# EAGLE design AmpSSM2019_2312 (EAGLE 8.7.1)
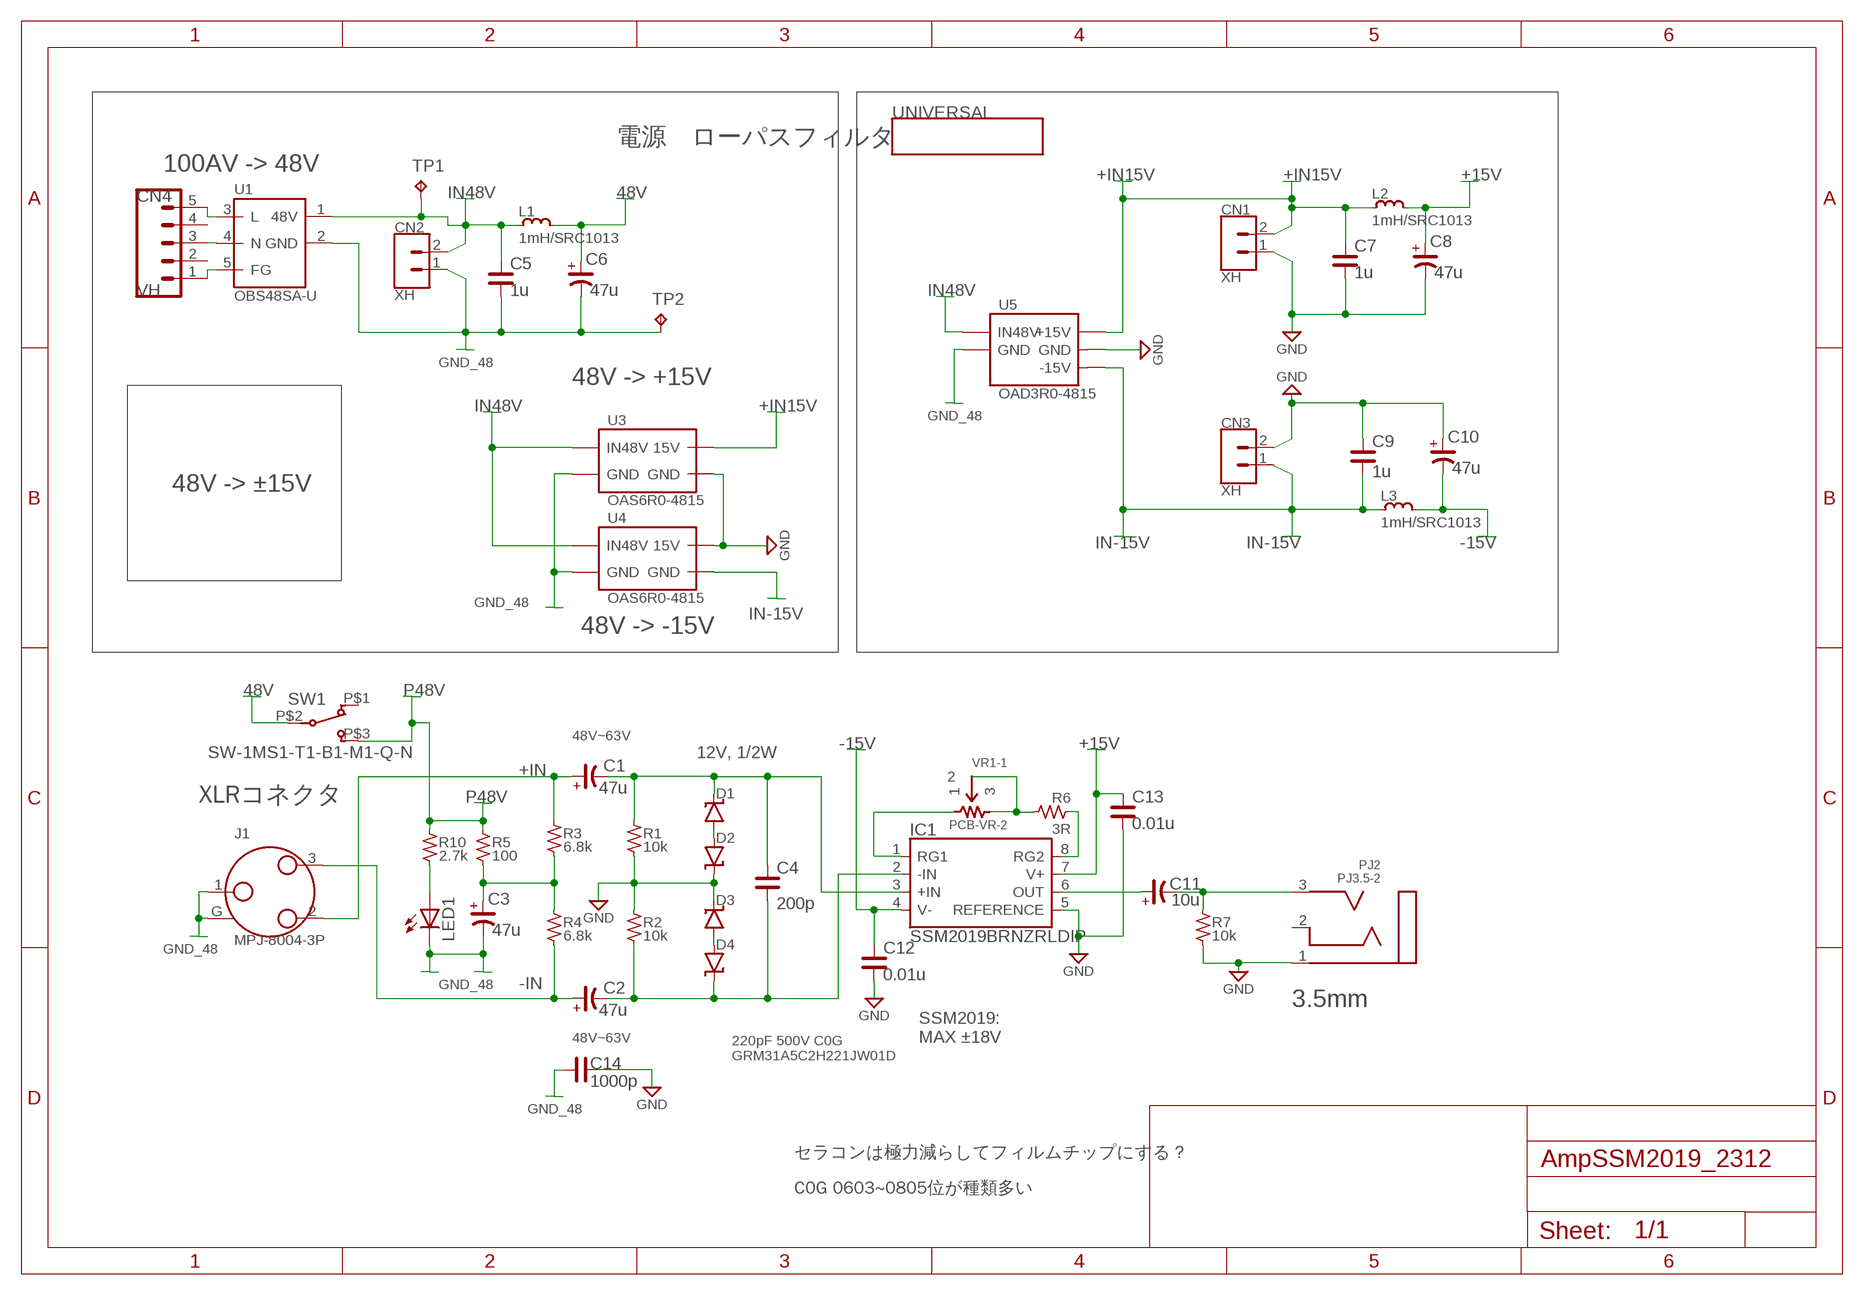
[diagram p0: schematic, sheet 1]

## Parts
C1  47u  CP_C025X065  [CE-025X065]
C2  47u  CP_C025X065  [CE-025X065]
C3  47u  CP_C025X065  [CE-025X065]
C4  200p  C_1206  [C1206]
C5  1u  C_1206  [C1206]
C6  47u  CP_C025X065  [CE-025X065]
C7  1u  C_1206  [C1206]
C8  47u  CP_C025X065  [CE-025X065]
C9  1u  C_1206  [C1206]
C10  47u  CP_C025X065  [CE-025X065]
C11  10u  CP_C025X065  [CE-025X065]
C12  0.01u  C_0603  [C0603]
C13  0.01u  C_0603  [C0603]
C14  1000p  C_1206  [C1206]
CN1  XH  CN-B2B-XH-A  [B2B-XH-A]
CN2  XH  CN-B2B-XH-A  [B2B-XH-A]
CN3  XH  CN-B2B-XH-A  [B2B-XH-A]
CN4  VH  M05VH  [VH5]
D1  ZD323  [SOD-323]
D2  ZD323  [SOD-323]
D3  ZD323  [SOD-323]
D4  ZD323  [SOD-323]
IC1  SSM2019BRNZRLDIP  [DIL08]
J1  MPJ-8004-3P  [MPJ-8004-3P]
L1  1mH/SRC1013  L_13X15  [L13X15]
L2  1mH/SRC1013  L_13X15  [L13X15]
L3  1mH/SRC1013  L_13X15  [L13X15]
LED1  LED3MM  [LED3MM]
PJ2  PJ3.5-2  [PJ3.5-2]
R1  10k  R_0603  [R0603]
R2  10k  R_0603  [R0603]
R3  6.8k  R_0603  [R0603]
R4  6.8k  R_0603  [R0603]
R5  100  R_0603  [R0603]
R6  3R  R_0603  [R0603]
R7  10k  R_0603  [R0603]
R10  2.7k  R_0603  [R0603]
SW1  SW-1MS1-T1-B1-M1-Q-N  [1MS1-T1-B1-M1-Q-N]
TP1  TPPAD1-13  [P1-13]
TP2  TPPAD1-13  [P1-13]
U1  OBS48SA-U  [OBS48SA-U]
U2  UNIVERSAL10X10  [UNIVERSAL10X10]
U3  OAS6R0-4815  [OAS6R0-4815]
U4  OAS6R0-4815  [OAS6R0-4815]
U5  OAD3R0-4815  [OAD3R0-4815]
VR1  PCB-VR-2  [PCB-VR-2]

## Nets
48V: C6.+ L1.2 SW1.P$2(P)
+15V: C8.+ C13.2 IC1.7(V+) L2.2
+IN: C1.+ J1.2 R3.2
+IN15V: C7.2 CN1.2 L2.1 U3.V_OUT(15V) U5.V+_OUT(+15V)
-15V: C10.- C12.2 IC1.4(V-) L3.2
-IN: C2.+ J1.3 R4.1
FG: CN4.1 U1.5(FG)
GND: C7.1 C8.- C9.1 C10.+ C12.1 C13.1 C14.1 CN1.1 CN3.2 D2.K(C) D3.K(C) IC1.5(REFERENCE) PJ2.1(S) R1.1 R2.2 R7.1 U3.G_OUT(GND) U4.V_OUT(15V) U5.G_OUT(GND) ; supply symbol labelled G
GND_48: C3.- C5.1 C6.- C14.2 CN2.1 J1.1 J1.G LED1.K(C) TP2.TP U1.2(GND) U3.G_IN(GND) U4.G_IN(GND) U5.G_IN(GND)
IN48V: C5.2 CN2.2 L1.1 TP1.TP U1.1(48V) U3.VIN(IN48V) U4.VIN(IN48V) U5.VIN(IN48V)
IN-15V: C9.2 CN3.1 L3.1 U4.G_OUT(GND) U5.V-_OUT(-15V)
L: CN4.5 U1.3(L)
N: CN4.3 U1.4(N)
N$1: IC1.8(RG2) R6.1
N$2: IC1.1(RG1) VR1.3
N$3: R6.2 VR1.1 VR1.2
N$4: C1.- C4.2 D1.K(C) IC1.3(+IN) R1.2
N$5: C11.+ IC1.6(OUT)
N$6: C2.- C4.1 D4.K(C) IC1.2(-IN) R2.1
N$7: D1.A D2.A
N$8: C11.- PJ2.3(TIP) R7.2
N$9: C3.+ R3.1 R4.2 R5.1
N$10: D3.A D4.A
N$14: LED1.A R10.1
P48V: R5.2 R10.2 SW1.P$3(S)
Unconnected: CN4.2 CN4.4 PJ2.2(RING) SW1.P$1(O) VR1.4 VR1.5 VR1.6

## Notes on the sheet
- 電源　ローパスフィルタ
- 100AV -> 48V
- 48V -> +15V
- 48V -> ±15V
- 48V -> -15V
- 48V~63V
- 12V, 1/2W
- XLRコネクタ
- 3.5mm
- 48V~63V
- SSM2019:
  MAX ±18V
- 220pF 500V C0G
  GRM31A5C2H221JW01D
- セラコンは極力減らしてフィルムチップにする？
- C0G 0603~0805位が種類多い

## Library data of the parts
C1-C3 C6 C8 C10 C11 = 0JimCom-Cap:CP_
C4 C5 C7 C9 C12-C14 = Miya_IC:C_: NON-POLARIZED CAP
CN1-CN3 = my_lib:CN-B2B-XH-A
CN4 = Miya_Parts:M05: Header 3 Standard 3-pin 0.1" header.
D1-D4 = my_lib:ZD
IC1 = SamacSys_Parts:SSM2019BRNZRL: Audio Preamplifier Source: Datasheet <http://componentsearchengine.com/Datasheets/1/SSM2019BRNZRL.pdf>
J1 = Miya_Parts:MPJ-8004-3P
L1-L3 = Miya_IC:L_: INDUCTOR
LED1 = 0JimCom-Analog:LED: LED OSRAM: - CHIPLED LG R971, LG N971, LY N971, LG Q971, LY Q971, LO R971, LY R971 LH N974, LH R974 LS Q976, LO Q976, LY Q976 LO Q996 - Hyper CHIPLED LW Q18S LB Q993, LB Q99A, LB R99A - SideLED LS A670, LO A670, LY A670, LG A670, LP A670 LB A673, LV A673, LT A673, LW A673 LH A674 LY A675 LS A676, LA A676, LO A676, LY A676, LW A676 LS A679, LY A679, LG A679 - Hyper Micro SIDELED® LS Y876, LA Y876, LO Y876, LY Y876 LT Y87S - SmartLED LW L88C, LW L88S LB L89C, LB L89S, LG L890 LS L89K, LO L89K, LY L89K LS L896, LA L896, LO L896, LY L896 - TOPLED LS T670, LO T670, LY T670, LG T670, LP T670 LSG T670, LSP T670, LSY T670, LOP T670, LYG T670 LG T671, LOG T671, LSG T671 LB T673, LV T673, LT T673, LW T673 LH T674 LS T676, LA T676, LO T676, LY T676, LB T676, LH T676, LSB T676, LW T676 LB T67C, LV T67C, LT T67C, LS T67K, LO T67K, LY T67K, LW E67C LS E67B, LA E67B, LO E67B, LY E67B, LB E67C, LV E67C, LT E67C LW T67C LS T679, LY T679, LG T679 LS T770, LO T770, LY T770, LG T770, LP T770 LB T773, LV T773, LT T773, LW T773 LH T774 LS E675, LA E675, LY E675, LS T675 LS T776, LA T776, LO T776, LY T776, LB T776 LHGB T686 LT T68C, LB T68C - Hyper Mini TOPLED® LB M676 - Mini TOPLED Santana® LG M470 LS M47K, LO M47K, LY M47K Source: http://www.osram.convergy.de - LUMILED® LXK2-PW12-R00, LXK2-PW12-S00, LXK2-PW14-U00, LXK2-PW14-V00 LXK2-PM12-R00, LXK2-PM12-S00, LXK2-PM14-U00 LXK2-PE12-Q00, LXK2-PE12-R00, LXK2-PE12-S00, LXK2-PE14-T00, LXK2-PE14-U00 LXK2-PB12-K00, LXK2-PB12-L00, LXK2-PB12-M00, LXK2-PB14-N00, LXK2-PB14-P00, LXK2-PB14-Q00 LXK2-PR12-L00, LXK2-PR12-M00, LXK2-PR14-Q00, LXK2-PR14-R00 LXK2-PD12-Q00, LXK2-PD12-R00, LXK2-PD12-S00 LXK2-PH12-R00, LXK2-PH12-S00 LXK2-PL12-P00, LXK2-PL12-Q00, LXK2-PL12-R00 Source: www.luxeon.com
PJ2 = my_lib:PJ3.5-2
R1-R7 R10 = Miya_IC:R_: RESISTOR
SW1 = Miya_Parts:SW-1MS1-T1-B1-M1-Q-N
TP1 TP2 = testpad:TP: Test pad
U1 = Miya_Parts:OBS48SA-U
U2 = Miya_Parts:UNIVERSAL
U3 U4 = Miya_Parts:OAS6R0-4815
U5 = Miya_Parts:OAD3R0-4815
VR1 = my_lib:PCB-VR-2

## Board
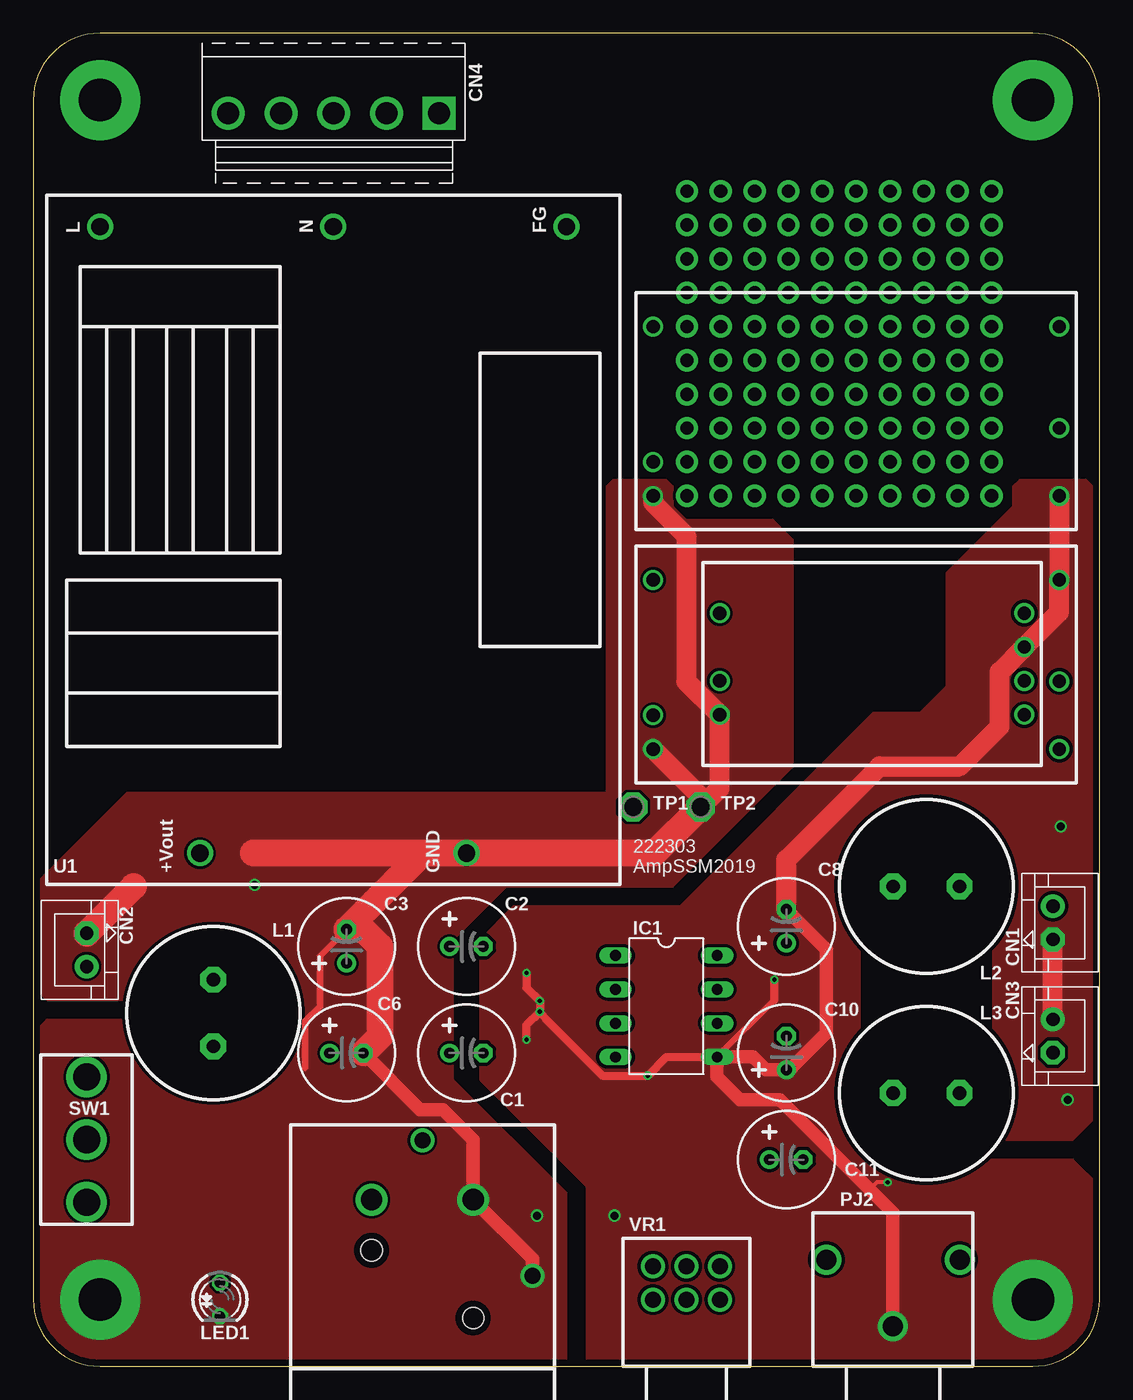
[diagram p1: board, top side]
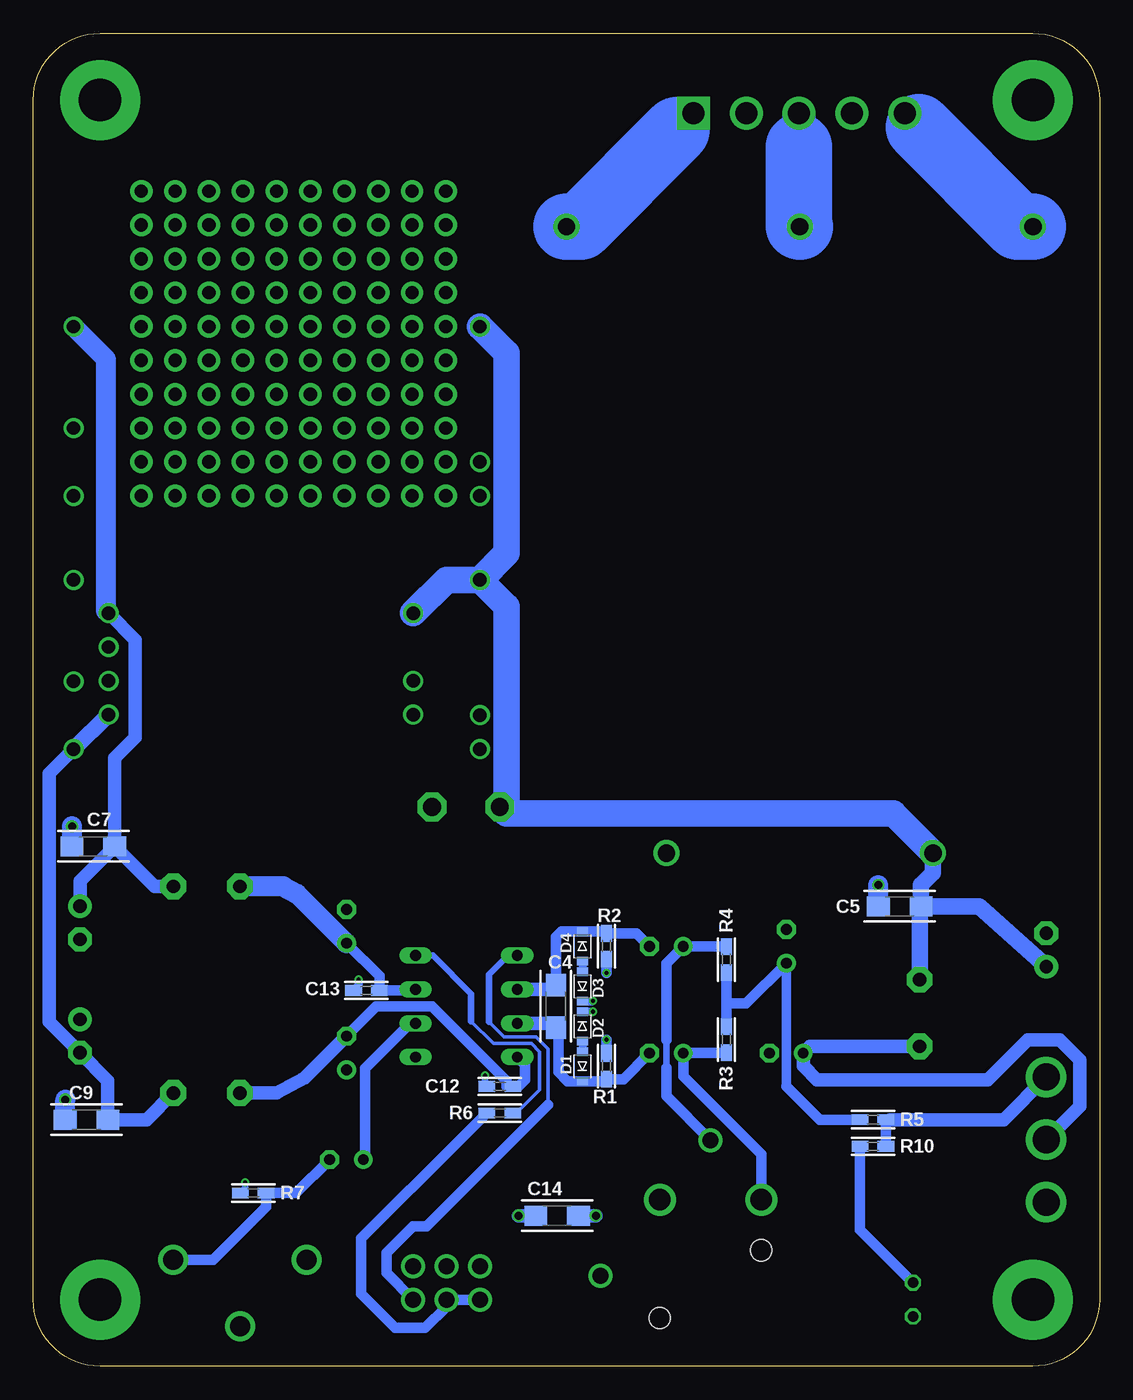
[diagram p2: board, bottom side, seen from below]

Size 80 x 100 mm. Coordinates in mm from the lower left corner, seen from the top.
Outline: 0,95 0,5 arc90 5,0 75,0 arc90 80,5 80,95 arc90 75,100 5,100 arc90 0,95
Copper layers (1*16): Top 0.035mm / dielectric 1.6mm / Bottom 0.035mm
Design rules "Elecrow_2-layer_PCB_eagle_rule *": minimum track width 6mil, minimum drill 12mil, track to track 6mil, track to pad 8mil, pad to pad 12mil, via to via 12mil, smd to smd 0mil, copper to edge 20mil, drill to drill 10mil, minimum pad ring 6mil, minimum via ring 6mil, stop-mask expansion 0mil, vias tented up to drill 0mil, thermal gap 10mil

### Footprints (pad centres in the part's own frame; a part is rotated, then mirrored left to right if it is on the bottom)
CE-025X065 = drill 0.8 pad 1.4: + -1.27,0 | drill 0.8 pad 1.4 octagon: - 1.27,0
C1206 = smd 1.7 x 1.5: 1 -1.6,0; 2 1.6,0
C0603 = smd 1.25 x 0.8: 1 -0.965,0; 2 0.965,0
B2B-XH-A = drill 1 pad 1.778 octagon: 1 0.02,0 | drill 1 pad 1.778: 2 2.52,0
VH5 = drill 1.65 square: 1 0,0 | drill 1.65: 2 3.96,0; 3 7.92,0; 4 11.88,0; 5 15.84,0
SOD-323 = smd 0.83 x 0.63: A 0,-1.115; K 0,1.115
DIL08 = drill 0.813 long: 1 -3.81,3.81; 2 -3.81,1.27; 3 -3.81,-1.27; 4 -3.81,-3.81; 5 3.81,-3.81; 6 3.81,-1.27; 7 3.81,1.27; 8 3.81,3.81
MPJ-8004-3P = drill 1.6: 1 0,0; 2 7.62,0 | drill 1.2: 3 3.81,-4.45; G -4.44,5.72 | hole 1.6: 7.62,3.81; 0,8.89
L13X15 = drill 1 pad 1.93 octagon: 1 0,0; 2 5,0
LED3MM = drill 0.8 octagon: A -1.27,0; K 1.27,0
PJ3.5-2 = drill 1.5: 1 0,0; 2 -5,5; 3 5,5
R0603 = smd 1.25 x 0.8: 1 -0.965,0; 2 0.965,0
1MS1-T1-B1-M1-Q-N = drill 2.03: P$1 0,-4.7; P$2 0,0; P$3 0,4.7
P1-13 = drill 1.321 pad 2.159 octagon: TP 0,0
OBS48SA-U = drill 1.3: 1 -23.5,10; 2 -23.5,-10; 3 23.5,17.5; 4 23.5,0; 5 23.5,-17.5
UNIVERSAL10X10 = drill 1 pad 1.676: P$1 0,0; P$2 2.54,0; P$3 5.08,0; P$4 7.62,0; P$5 10.16,0; P$6 12.7,0; P$7 15.24,0; P$8 17.78,0; P$9 20.32,0; P$10 22.86,0; P$13 0,2.54; P$14 2.54,2.54; P$15 5.08,2.54; P$16 7.62,2.54; P$17 10.16,2.54; P$18 12.7,2.54; P$19 15.24,2.54; P$20 17.78,2.54; P$21 20.32,2.54; P$22 22.86,2.54; P$25 0,5.08; P$26 2.54,5.08; P$27 5.08,5.08; P$28 7.62,5.08; P$29 10.16,5.08; P$30 12.7,5.08; P$31 15.24,5.08; P$32 17.78,5.08; P$33 20.32,5.08; P$34 22.86,5.08; P$37 0,7.62; P$38 2.54,7.62; P$39 5.08,7.62; P$40 7.62,7.62; P$41 10.16,7.62; P$42 12.7,7.62; P$43 15.24,7.62; P$44 17.78,7.62; P$45 20.32,7.62; P$46 22.86,7.62; P$49 0,10.16; P$50 2.54,10.16; P$51 5.08,10.16; P$52 7.62,10.16; P$53 10.16,10.16; P$54 12.7,10.16; P$55 15.24,10.16; P$56 17.78,10.16; P$57 20.32,10.16; P$58 22.86,10.16; P$61 0,12.7; P$62 2.54,12.7; P$63 5.08,12.7; P$64 7.62,12.7; P$65 10.16,12.7; P$66 12.7,12.7; P$67 15.24,12.7; P$68 17.78,12.7; P$69 20.32,12.7; P$70 22.86,12.7; P$73 0,15.24; P$74 2.54,15.24; P$75 5.08,15.24; P$76 7.62,15.24; P$77 10.16,15.24; P$78 12.7,15.24; P$79 15.24,15.24; P$80 17.78,15.24; P$81 20.32,15.24; P$82 22.86,15.24; P$85 0,17.78; P$86 2.54,17.78; P$87 5.08,17.78; P$88 7.62,17.78; P$89 10.16,17.78; P$90 12.7,17.78; P$91 15.24,17.78; P$92 17.78,17.78; P$93 20.32,17.78; P$94 22.86,17.78; P$97 0,20.32; P$98 2.54,20.32; P$99 5.08,20.32; P$100 7.62,20.32; P$101 10.16,20.32; P$102 12.7,20.32; P$103 15.24,20.32; P$104 17.78,20.32; P$105 20.32,20.32; P$106 22.86,20.32; P$109 0,22.86; P$110 2.54,22.86; P$111 5.08,22.86; P$112 7.62,22.86; P$113 10.16,22.86; P$114 12.7,22.86; P$115 15.24,22.86; P$116 17.78,22.86; P$117 20.32,22.86; P$118 22.86,22.86
OAS6R0-4815 = drill 1: G_IN 0,-12.7; G_OUT 30.48,-12.7; P$1 0,-10.16; P$2 30.48,-7.62; V_OUT 30.48,0; VIN 0,0
OAD3R0-4815 = drill 1: G_IN 0,-7.62; G_OUT 22.86,-2.54; P$1 0,-5.08; P$2 22.86,-5.08; V+_OUT 22.86,0; V-_OUT 22.86,-7.62; VIN 0,0
PCB-VR-2 = drill 1.2: 1 0,0; 2 2.5,0; 3 5,0; 4 0,2.5; 5 2.5,2.5; 6 5,2.5

### Placement (x,y rotation side)
C1  32.5,23.5 0 top
C2  32.5,31.5 0 top
C3  23.5,31.5 90 top
C4  40.8,27 270 bottom
C5  15,34.5 0 bottom
C6  23.5,23.5 0 top
C7  75.5,39 0 bottom
C8  56.5,33 90 top
C9  76,18.5 0 bottom
C10  56.5,23.5 90 top
C11  56.5,15.5 0 top
C12  45,21 0 bottom
C13  55,28.2 0 bottom
C14  40.7,11.3 0 bottom
CN1  76.5,32 90 top
CN2  4,32.5 270 top
CN3  76.5,23.5 90 top
CN4  30.46,94 180 top
D1  38.8,22.5 180 bottom
D2  38.8,25.5 0 bottom
D3  38.8,28.5 180 bottom
D4  38.8,31.5 0 bottom
IC1  47.5,27 0 top
J1  33,12.5 180 top
L1  13.5,29 270 top
L2  69.5,36 180 top
L3  69.5,20.5 180 top
LED1  14,5 270 top
PJ2  64.5,3 0 top
R1  37,22.5 270 bottom
R2  37,31.5 270 bottom
R3  28,24.5 270 bottom
R4  28,30.5 270 bottom
R5  17,18.5 0 bottom
R6  45,19 180 bottom
R7  63.5,13 0 bottom
R10  17,16.5 0 bottom
SW1  4,17 0 top
TP1  45,41.96 0 top
TP2  50.08,41.96 0 top
U1  22.5,62 90 top
U2  49.04,65.3 0 top
U3  46.5,78 0 top
U4  46.5,59 0 top
U5  51.5,56.5 0 top
VR1  46.5,5 0 top

### Tracks (layer width: path | path; a pad name or v marks a point on that pad's centre or on a via)
48V
  Bottom 1: L1.2 21.73,24 C6.+ 22.23,22.53 21.2,21.5 20.73,21.5 8.4,21.5 5.4,24.5 3,24.5 1.5,23 1.5,19.5 SW1.P$2
+15V
  Bottom 0.8: IC1.7 51.38,28.2 C13.2 54.03,29.27 C8.+
  Bottom 1.5: L2.2 61.25,36 60.22,35.45 C8.+
+IN
  Bottom 0.5: R3.2 28.04,23.5
  Bottom 0.8: 28.04,23.5 C1.+ 31.23,21.73 25.38,15.88 J1.2
+IN15V
  Bottom 1: 74.53,56.67 U5.V+_OUT 72.36,54.5 72.36,47.17 73.9,45.63 C7.2 | L2.1 70.9,36 C7.2 | C7.2 76.5,36.4 CN1.2
  Bottom 1.5: 74.53,56.67 74.53,75.56 U3.V_OUT
-15V
  Bottom 0.8: C10.- 54.27,27 50.09,27 44.5,21.41 44.5,21 C12.2 43.6,21 43.1,21.5 43.1,22.6 IC1.4
  Bottom 1: C10.- 59.65,21.62 61.75,20.5 L3.2
-IN
  Bottom 0.5: 32.51,24.5 32.51,22.39 | R4.1 28.04,31.5
  Bottom 0.8: 28.04,31.5 C2.+ 32.51,30.22 32.51,24.5 | J1.3 32.51,20.27 32.51,22.39
FG
  Bottom 2.5: 31.73,92.73 CN4.1
  Bottom 5: U1.5 38.96,85.5 31.73,92.73
GND  (via drill 0.3, 0.6, 3.2 pad 6)
  Top 0.3: v64.1,13.8 63.3,13.8 62.5,13 63,13
  Top 0.5: IC1.5 55.6,27.48
  Top 0.6: IC1.5 47.49,23.19 v46.1,21.8 42.7,21.8 38.5,26 v38,26.6 | v37,24.5 37,25.6 v38,26.6 | v37,29.5 37,28.4 v38,27.4 v38,26.6 | 55.6,27.48 v55.6,29
  Top 1: PJ2.1 64.5,11.5 63,13 56,20 53,20 51.31,21.69 IC1.5 54,23.19 54.96,22.23 C10.+ 56.73,22.23 59.5,25 59.5,31.27 C8.-
  Top 1.5: U3.G_OUT U4.V_OUT 76.98,56.58 U5.G_OUT 72.5,52.1 72.5,48 69.5,45 63.5,45 56.5,38 C8.- | CN3.2 CN1.1
  Bottom 0.25: 37.08,23.54 R1.1
  Bottom 0.5: v46.1,21.8 46.1,20.86 C12.1 | v64.1,13.8 64.1,13.37 R7.1 | 37,24.53 v37,24.5 | 38.02,26.61 v38,26.6 | 38.02,27.39 v38,27.4
  Bottom 0.6: v55.6,29 55.6,28.57 C13.1 | D2.K 38.02,26.61 | D3.K 38.02,27.39
  Bottom 0.8: R2.2 v37,29.5 | R1.1 v37,24.5
  Bottom 1: C14.1 v43.6,11.3
  Bottom 1.5: C9.1 v77.6,20 | C7.1 v77.1,40.5
  other vias: 75,5
  pour Top (isolate 0.254, no thermals): 33.5,21.5 41.5,13.5 41.5,0 80,0 80,13.5 78,15.5 63.5,15.5 62,17 62,32 72,32 72,17.5 72.5,17 78,17 80,19 80,65.5 79,66.5 74,66.5 73.5,66 73.5,64.5 68.5,59.5 68.5,51 66.5,49 63,49 48.5,34.5 36,34.5 33.5,32
GND_48  (via drill 0.6, 3.2 pad 6)
  Top 0.5: C3.- 21.5,30.77 21.5,27 20.39,25.89 20.39,22.39
  Top 1: J1.G 37.44,8.06 J1.1 33,17 30.75,19.25 29.02,19.25 C6.-
  Top 1.5: U4.G_IN 50.08,42.72 TP2.TP 51.5,43.38 U5.G_IN 49,51.38 49,62.3 46.5,64.8 U3.G_IN
  Top 2: U1.2 46.62,38.5 TP2.TP | U1.2 29.23,38.5 C3.- 24.73,32.77 26,31.5 26,24.73 C6.- | CN2.1 7.52,36 | 16.5,38.5 U1.2
  Bottom 1: C14.2 v37.8,11.3
  Bottom 1.5: C5.1 v16.6,36.1
  other vias: 5,5
  pour Top (isolate 0.2, no thermals): 0,0 40,0 40,13 31.5,21.5 31.5,32 35.5,36 48,36 57,45 57,62 55.5,63.5 49,63.5 48,64.5 48,66 47.5,66.5 43.5,66.5 43,66 43,43 7,43 0,36 0,28.5 1,27.5 7.5,27.5 7.5,26 1,26 0,25
IN48V
  Bottom 1: U1.1 12.5,38 | CN2.2 4.01,29.98
  Bottom 1.25: U1.1 12.5,37 13.4,36.1 C5.2 | CN2.2 8.98,34.47 9.02,34.5 C5.2 | L1.1 13.5,34.4 C5.2
  Bottom 2: U1.1 15.46,41.46 44.5,41.46 TP1.TP 44.5,42.46 44.5,57 U4.VIN | U4.VIN 44.5,61 44.5,76 U3.VIN | U4.VIN 49,59 U5.VIN
IN-15V
  Bottom 1: U4.G_OUT 78.8,44.48 78.8,25.82 CN3.1 74.4,21.42 C9.2 71.5,18.5 L3.1
  Bottom 1.25: U5.V-_OUT U4.G_OUT
L
  Bottom 2.5: 13.56,92.94 CN4.5
  Bottom 5: U1.3 6.12,85.5 13.56,92.94
N
  Bottom 2.5: CN4.3 22.54,91.5
  Bottom 5: U1.4 22.54,85.54 22.54,91.5
N$1
  Bottom 0.25: 47.14,25.88 45.47,24.2 42.63,24.2 42.02,23.59 42.02,20.72 43.73,19 R6.1
  Bottom 0.5: IC1.8 50.01,30.81 47.14,27.94 47.14,25.88
N$2
  Bottom 0.25: 41.4,19.6 41.4,23.82 42.3,24.72 44.7,24.72 45.81,25.83
  Bottom 0.5: IC1.1 44.39,30.81 45.81,29.39 45.81,25.83
  Bottom 0.8: VR1.3 53.5,7 53.5,8.5 51.5,10.5 50.5,10.5 41.4,19.6
N$3
  Bottom 0.8: R6.2 48,17 55.41,9.6 55.41,5.45 52.84,2.88 50.59,2.88 49,4.47 VR1.2 VR1.1
N$4
  Bottom 0.8: C1.- 35.73,21.54 R1.2 37.15,21.39 D1.K 39.9,21.39 40.6,22.08 40.6,25.2 C4.2
  Bottom 1: IC1.3 41.13,25.73 C4.2
N$5
  Bottom 0.8: IC1.6 51.72,25.73 55.12,22.34 55.12,15.52 C11.+
N$6
  Bottom 0.5: 37.15,32.62 R2.1
  Bottom 0.8: 37.15,32.62 D4.K 40.38,32.62 40.8,32.2 C4.1 | C2.- 34.73,32.47 R2.1
  Bottom 1: C4.1 41.1,28.27 IC1.2
N$7
  Bottom 0.6: D2.A D1.A
N$8
  Bottom 0.8: C11.- 60.27,13 R7.2 62.53,11.96 66.5,8 PJ2.3
N$9
  Bottom 0.5: R3.1 28,27.22 | 23.53,30.2 C3.+
  Bottom 0.7: 23.5,21 C3.+
  Bottom 0.8: 28,27.22 26.51,27.22 C3.+ | R3.1 R4.2 | R5.1 20.96,18.46 23.5,21
N$10
  Bottom 0.6: D4.A D3.A
N$11  (via drill 3.2 pad 6)
  other vias: 75,95
N$12  (via drill 3.2 pad 6)
  other vias: 5,95
N$14
  Bottom 0.8: LED1.A 17.96,10.23 R10.1
P48V
  Bottom 0.8: 15.7,18.5 R5.2 R10.2
  Bottom 1: SW1.P$3 7.2,18.5 15.7,18.5

### Text on the board
tPlace: 222303 / AmpSSM2019